# Altium schematic sheet ADC.SchDoc
size A4; SheetNumber: 6; SheetTotal: 12
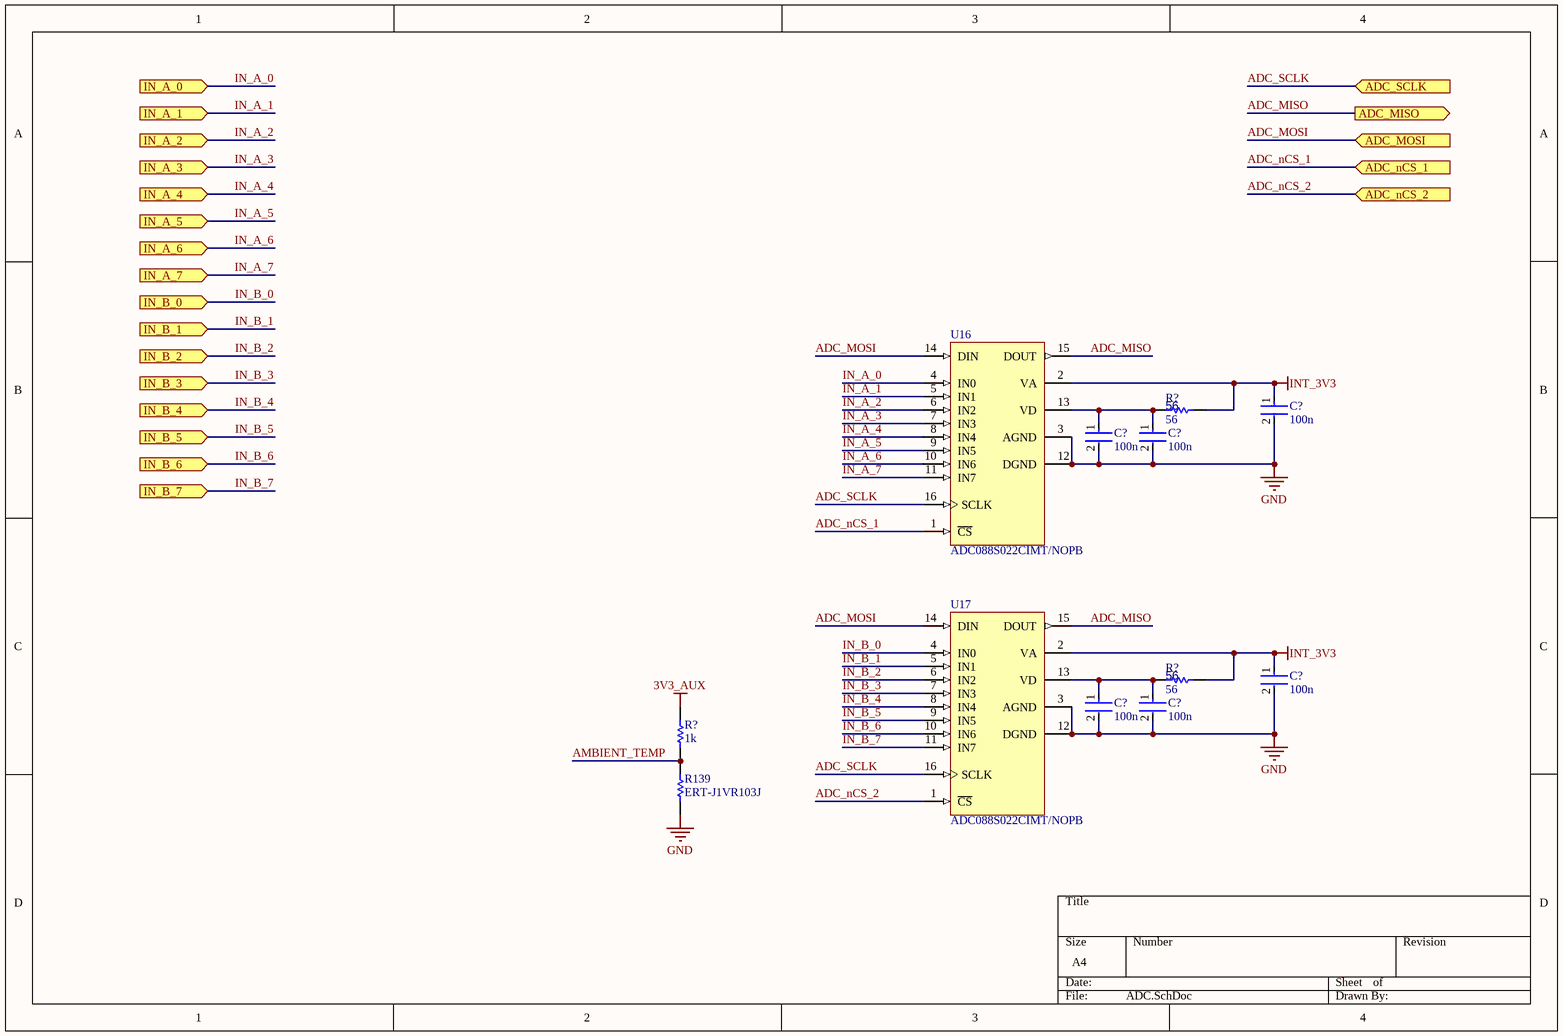
[diagram p0: ADC.SchDoc]

## Parts
(Parts that share a designator on the sheet are numbered #1, #2 ... from top to bottom, then left to right.)
C?#1  100n  [FP-0402-L_1_0_0_05-W_0_5-IPC_A]
C?#2  100n  [FP-0402-L_1_0_0_05-W_0_5-IPC_A]
C?#3  100n  [FP-0402-L_1_0_0_05-W_0_5-IPC_A]
C?#4  100n  [FP-0402-L_1_0_0_05-W_0_5-IPC_A]
C?#5  100n  [FP-0402-L_1_0_0_05-W_0_5-IPC_A]
C?#6  100n  [FP-0402-L_1_0_0_05-W_0_5-IPC_A]
R139  ERT-J1VR103J  [RESC1608X90X30ML15T20]
R?#1  56  [R0603B]
R?#2  56  [R0603B]
R?#3  1k  [R0603B]
U16  ADC088S022CIMT/NOPB  [MTC16_L]
U17  ADC088S022CIMT/NOPB  [MTC16_L]

## Ports
ADC_MISO (out, see CHILD_BOARD[3A]), ADC_MOSI (in, see CHILD_BOARD[3A]), ADC_nCS_1 (in, see CHILD_BOARD[3A]), ADC_nCS_2 (in, see CHILD_BOARD[3A]), ADC_SCLK (in, see CHILD_BOARD[3A]), IN_A_0 (in), IN_A_1 (in), IN_A_2 (in), IN_A_3 (in), IN_A_4 (in), IN_A_5 (in), IN_A_6 (in), IN_A_7 (in), IN_B_0 (in), IN_B_1 (in), IN_B_2 (in), IN_B_3 (in), IN_B_4 (in), IN_B_5 (in), IN_B_6 (in), IN_B_7 (in)

## Nets
3V3_AUX: R?#3.2
GND: C?#1.2 C?#2.2 C?#3.2 C?#4.2 C?#5.2 C?#6.2 R139.1 U16.3(AGND) U16.12(DGND) U17.3(AGND) U17.12(DGND)
INT_3V3: C?#1.1 C?#4.1 R?#1.1 R?#2.1 U16.2(VA) U17.2(VA)
ADC_MISO: U16.15(DOUT) U17.15(DOUT) ; port ADC_MISO
ADC_MOSI: U16.14(DIN) U17.14(DIN) ; port ADC_MOSI
ADC_nCS_1: U16.1(~{CS}) ; port ADC_nCS_1
ADC_nCS_2: U17.1(~{CS}) ; port ADC_nCS_2
ADC_SCLK: U16.16(SCLK) U17.16(SCLK) ; port ADC_SCLK
AMBIENT_TEMP: R139.2 R?#3.1
IN_A_0: U16.4(IN0) ; port IN_A_0
IN_A_1: U16.5(IN1) ; port IN_A_1
IN_A_2: U16.6(IN2) ; port IN_A_2
IN_A_3: U16.7(IN3) ; port IN_A_3
IN_A_4: U16.8(IN4) ; port IN_A_4
IN_A_5: U16.9(IN5) ; port IN_A_5
IN_A_6: U16.10(IN6) ; port IN_A_6
IN_A_7: U16.11(IN7) ; port IN_A_7
IN_B_0: U17.4(IN0) ; port IN_B_0
IN_B_1: U17.5(IN1) ; port IN_B_1
IN_B_2: U17.6(IN2) ; port IN_B_2
IN_B_3: U17.7(IN3) ; port IN_B_3
IN_B_4: U17.8(IN4) ; port IN_B_4
IN_B_5: U17.9(IN5) ; port IN_B_5
IN_B_6: U17.10(IN6) ; port IN_B_6
IN_B_7: U17.11(IN7) ; port IN_B_7
NetC?#2_1: C?#2.1 C?#3.1 R?#1.2 U16.13(VD)
NetC?#5_1: C?#5.1 C?#6.1 R?#2.2 U17.13(VD)

## Library data of the parts
C?#1-C?#6 = CMP-001-00058-1: LARGE PADS, 0402 CAP, CHANGE COMMENT TO MATCH REAL P/N; Capacitor Type: Ceramic; Min Operating Temperature: -55°C; Mounting Technology: Surface Mount; Pins: 2; Case/Package: 0402; RoHS Compliant: Yes; Max Operating Temperature: 85°C
R139 = CMP-2000-00869-1: Manufacturer: Panasonic; Part Number: ERT-J1VR103J
R?#1-R?#3 = CMP-009-00002-14: Resistor
  R?#1 R?#2: Value: 56
  R?#3: Value: 1k
U16 U17 = CMP-0054-00372-2: 8-Channel, 50 kSPS to 200 kSPS, 8-Bit A/D Converter, 16-pin TSSOP, Pb-Free; Manufacturer: National Semiconductor; PackageTopMarking: NSUZXYTT*88S022*CIMT; CompType: ADC IC; PowerWise: Y; ComponentLink2URL: http://www.national.com/pf/AD/ADC088S022.html; RoHS: Y; PackageDescription: Molded TSSOP, Jedec, 5 x 4.4 x 0.9mm Body, 16 Lead, 0.65mm Pitch; DatasheetVersion: Feb-2010; PinCount: 16; ComponentLink1Description: ADC088S022 Datasheet; Code_JEDEC: MO-153-AB; ComponentLink3URL: http://www.national.com/packaging/folders/mtc16.html; PackageVersion: revD, Jun-2003; ComponentLink3Description: MTC16 Package Page; RevisionNote: Component URLs added; ComponentLink1URL: http://www.national.com/ds/AD/ADC088S022.pdf; ComponentLink2Description: ADC088S022 Web Page; PackageReference: MTC16